# EasyEDA Pro project busmaster-v101.eprj, schematic base-board
Board Name: base-board; Create Date: 2025-09-19; Page Name: P1; Project Name: busmaster-v101; Schematic Name: base-board; Update Date: 2025-11-17; Company: EasyEDA.com; Page Size: A4; Version: V1.0
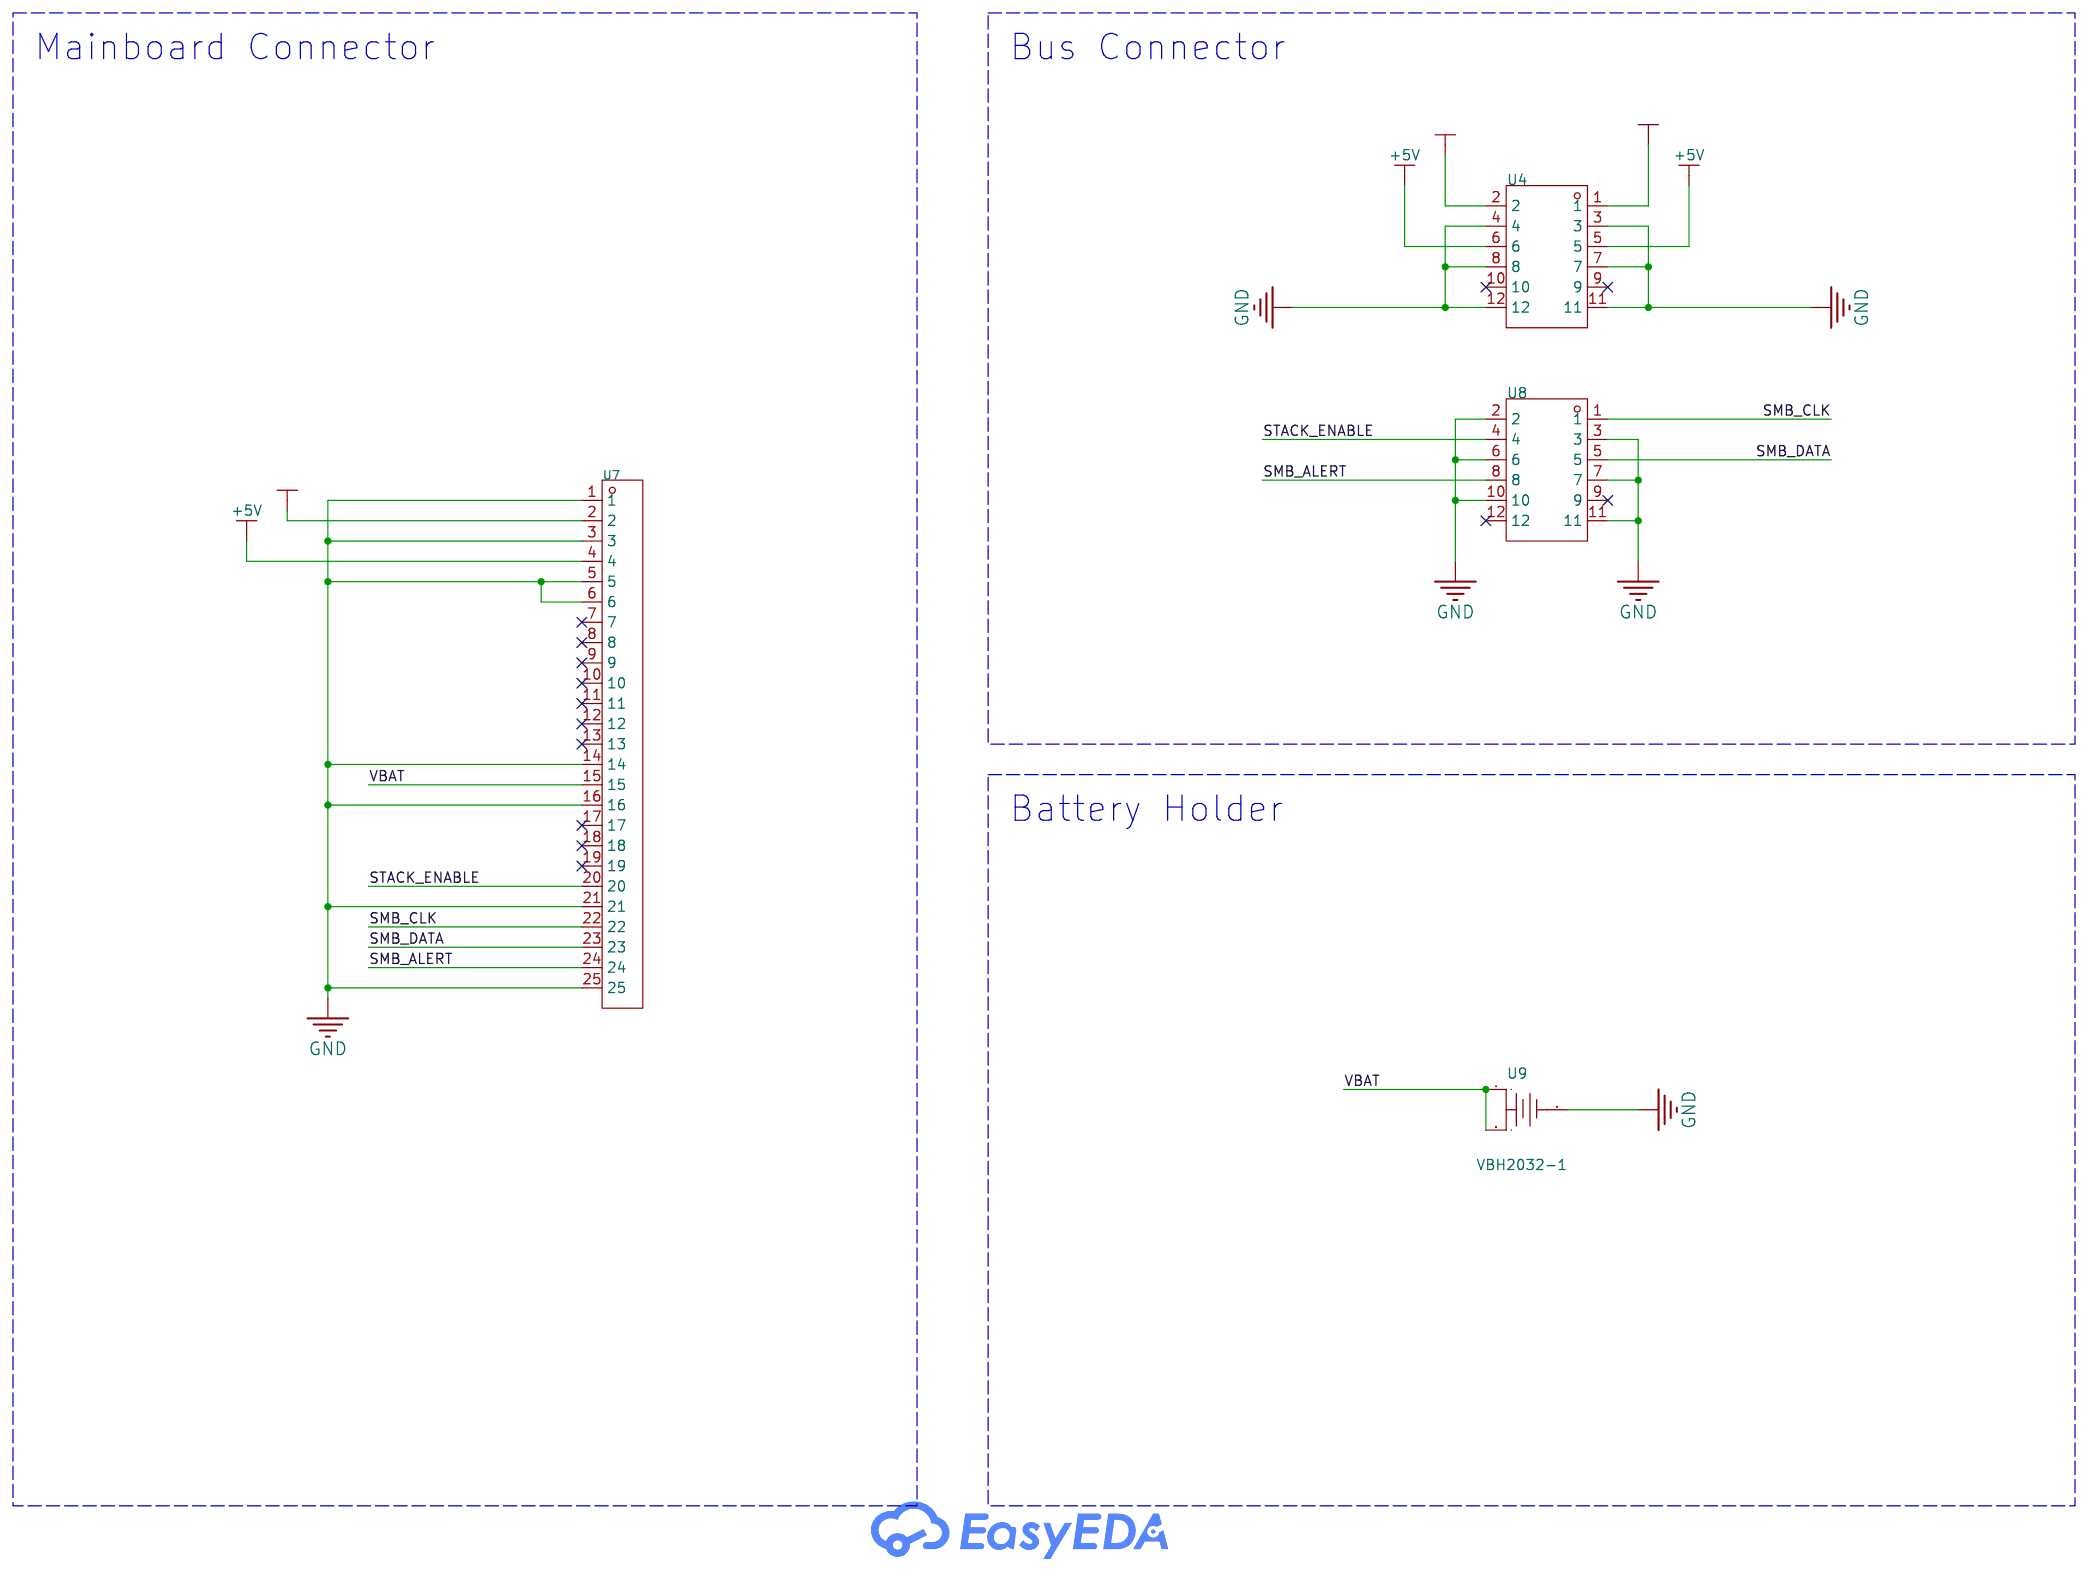
[diagram p0: schematic sheet]

## Parts
U4  2005FV-2x6P  [HDR-TH_12P-P2.00-V-F-R2-C6-S2.00]
U7  DW200R-11-25-43  [HDR-TH_25P-P2.00-V-F-1]
U8  2005FV-2x6P  [HDR-TH_12P-P2.00-V-F-R2-C6-S2.00]
U9  VBH2032-1  [BAT-TH_3P-L23.0-W6.0_VBH2032-1]

## Library data of the parts
U4 U8 = 2005FV-2x6P: Holes Structure:2x6P Pitch:2mm Row Spacing:2mm Circular Hole / Square Hole:Square Hole Mounting Type:Through Hole Number of Rows:2 Number of Positions:12P Current Rating:2A Holes Direction:Top Insulation Height:4.3mm Operating Temperature:-40℃~+105℃ Opera; LCSC Part Name: 间距:2mm 2x6P 直插; Supplier Part: C18723068; Manufacturer: HanElectricity(瀚源); Supplier Footprint: 插件,P=2mm; JLCPCB Part Class: Extended Part; Datasheet: https://item.szlcsc.com/datasheet/2005FV-2x6P/19915672.html; Supplier: LCSC; Holes Structure: 2x6P; Pitch: 2mm; Row Spacing: 2mm; Circular Hole / Square Hole: Square Hole; Mounting Type: Through Hole; Number of Rows: 2; Number of Positions: 12P; Current Rating: 2A; Holes Direction: Top; Insulation Height: 4.3mm; Operating Temperature: -40℃~+105℃
U7 = DW200R-11-25-43: Holes Structure:1x25P Pitch:2mm Mounting Type:Through Hole Number of Rows:1; LCSC Part Name: 1x25P 间距:2mm 直插; Supplier Part: C7506696; Manufacturer: DEALON(德艺隆); Supplier Footprint: 插件,P=2mm; Datasheet: https://item.szlcsc.com/datasheet/DW200R-11-25-43/8597336.html; Supplier: LCSC; Holes Structure: 1x25P; Pitch: 2mm; Mounting Type: Through Hole; Number of Rows: 1
U9 = VBH2032-1: Supplier Part: C19091283; Manufacturer: RENATA(瑞纳达); JLCPCB Part Class: Extended Part; Supplier: LCSC

## Nets
+5V: U4.5 U4.6 U7.4
+12V: U4.1 U4.2 U7.2
GND: U4.3 U4.4 U4.7 U4.8 U4.11 U4.12 U7.1 U7.3 U7.5 U7.6 U7.14 U7.16 U7.21 U7.25 U8.2 U8.3 U8.6 U8.7 U8.10 U8.11 U9.3(-)
VBAT: U7.15 U9.1(+) U9.2(+)
SMB_ALERT: U7.24 U8.8
SMB_CLK: U7.22 U8.1
SMB_DATA: U7.23 U8.5
STACK_ENABLE: U7.20 U8.4

Not connected (* = marked no-connect by the designer): U4 9* 10*; U7 7* 8* 9* 10* 11* 12* 13* 17* 18* 19*; U8 9* 12*

## Notes on the sheet
- Mainboard Connector
- Bus Connector
- Battery Holder
